# Altium project EvoHD_Pro.PrjPcb
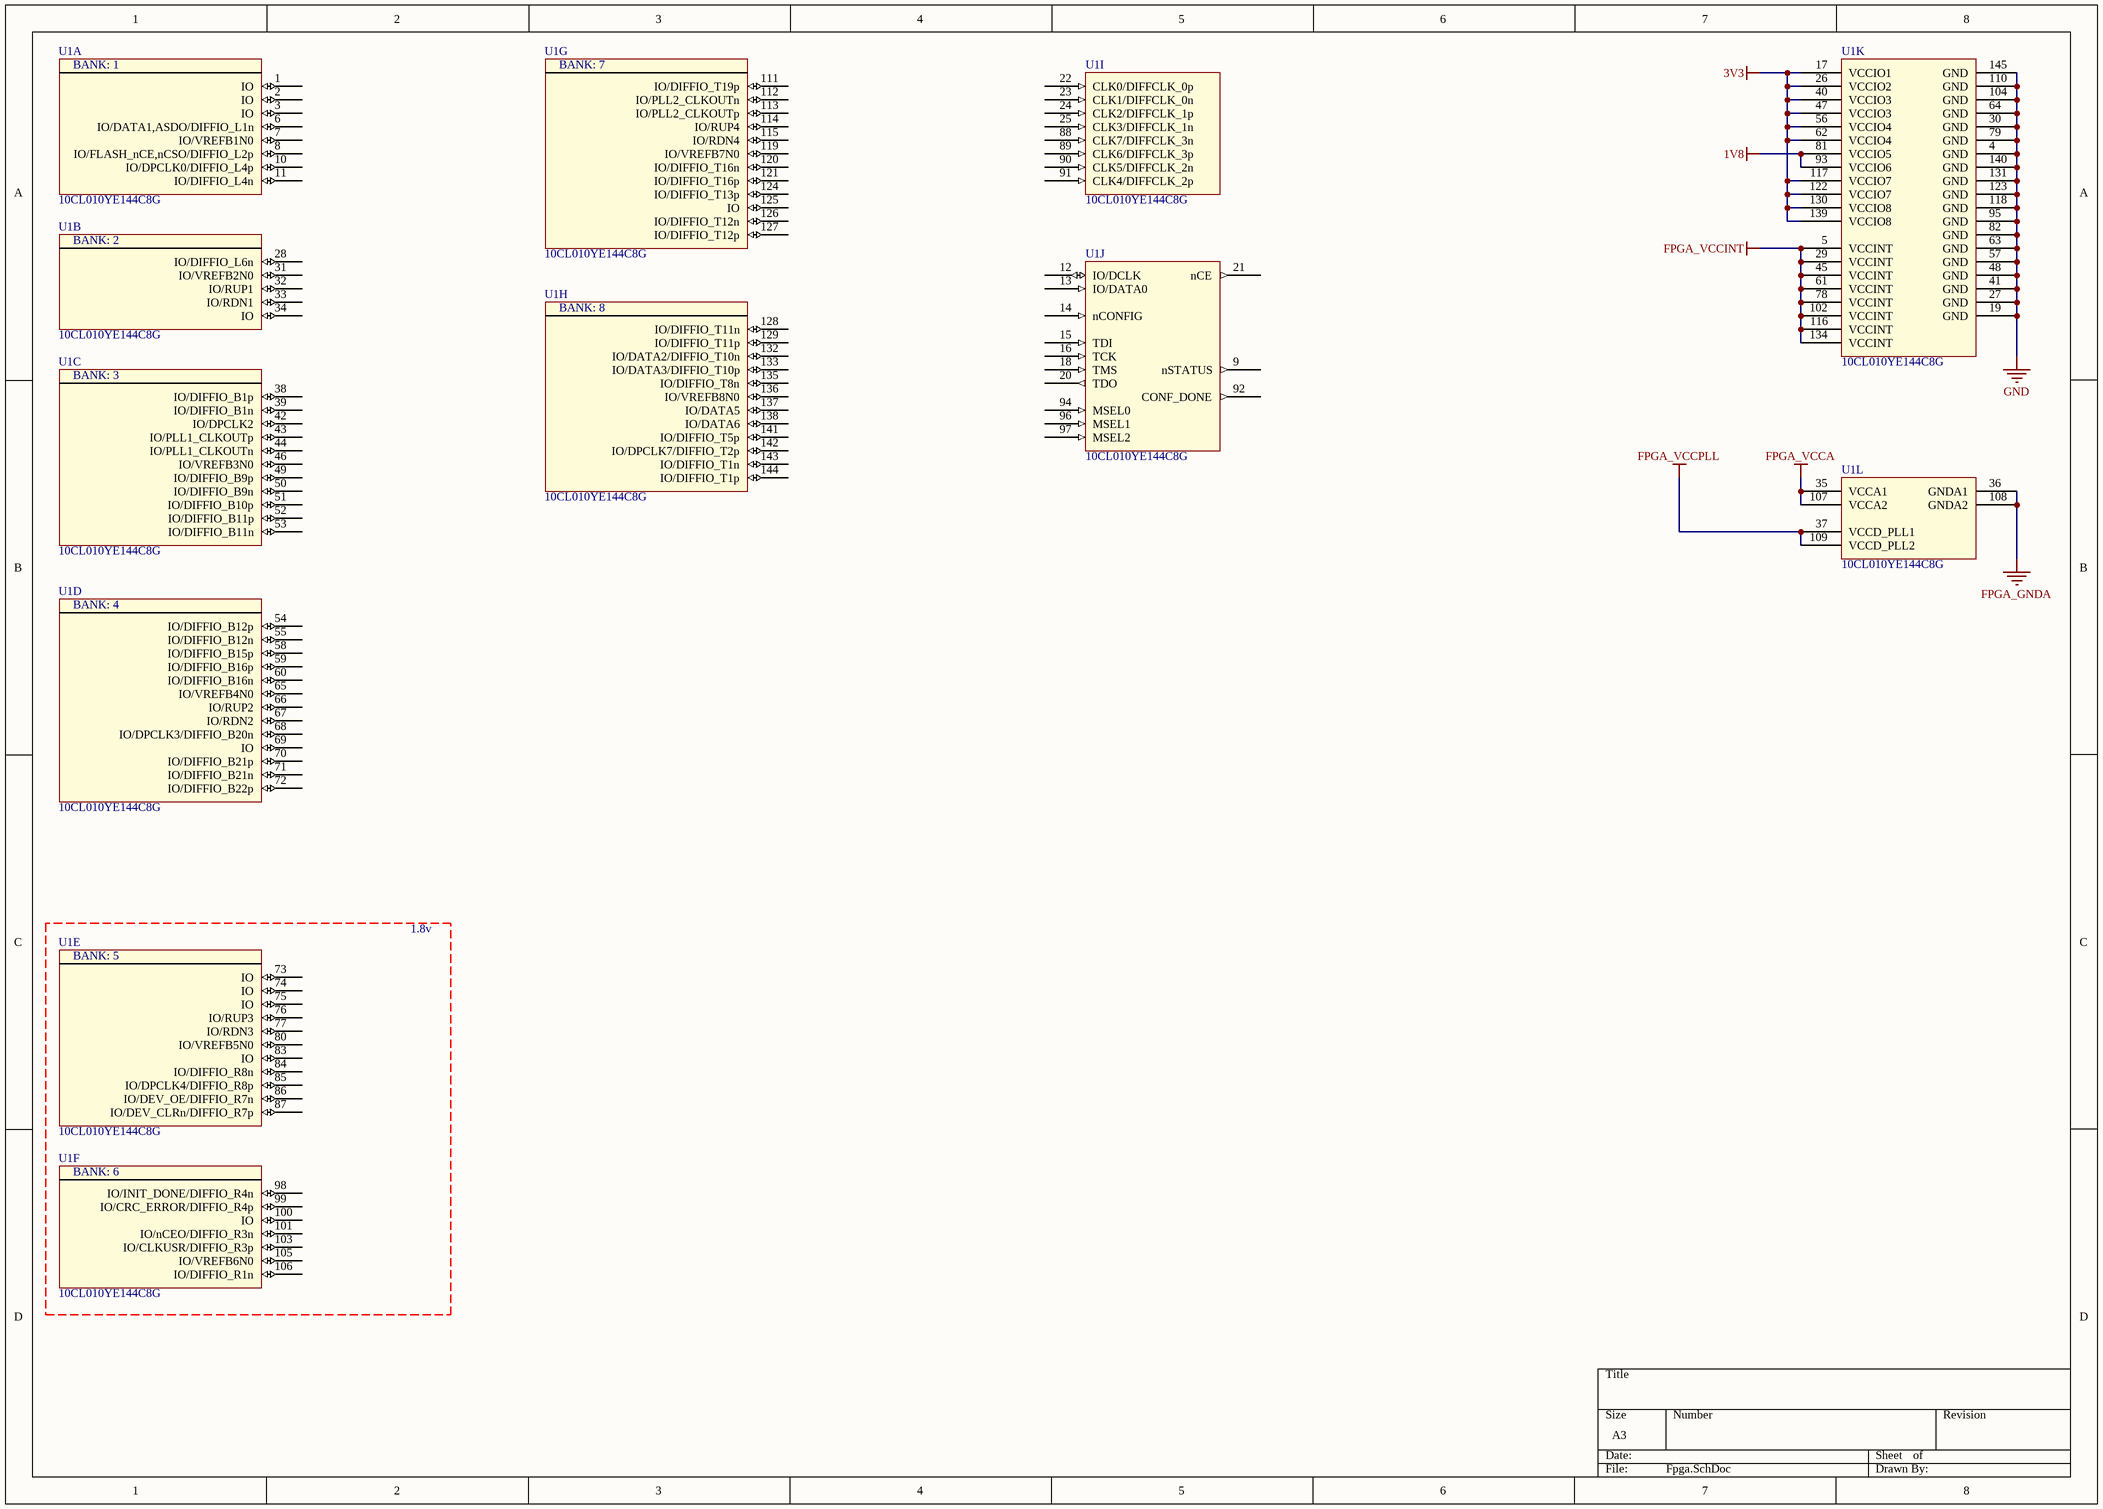
[diagram p0: Fpga.SchDoc]
7 sheets, 8 parts. Net scope: global (net labels, ports and power ports of the same name join across sheets).
Board file: EvoHD_Pro_RevA.PcbDoc
Sheets:
  Power.SchDoc
  Fpga.SchDoc
  Network.SchDoc
  Bus.SchDoc
  Hdmi.SchDoc
  Memory.SchDoc
  Connectors.SchDoc

## Sheet Power.SchDoc
size A4; SheetNumber: 1; SheetTotal: 1

## Sheet Fpga.SchDoc
size A3; SheetNumber: 2; SheetTotal: 7

### Parts
U1  10CL010YE144C8G  [Altera TQFP 50P 22X22 145N]  (parts A,B,C,D,E,F,G,H,I,J,K,L of 12)

### Blocks framed on the sheet
1.8v: U1

### Nets
1V8: U1.81(VCCIO5) U1.93(VCCIO6)
3V3: U1.17(VCCIO1) U1.26(VCCIO2) U1.40(VCCIO3) U1.47(VCCIO3) U1.56(VCCIO4) U1.62(VCCIO4) U1.117(VCCIO7) U1.122(VCCIO7) U1.130(VCCIO8) U1.139(VCCIO8)
FPGA_GNDA: U1.36(GNDA1) U1.108(GNDA2)
FPGA_VCCA: U1.35(VCCA1) U1.107(VCCA2)
FPGA_VCCINT: U1.5(VCCINT) U1.29(VCCINT) U1.45(VCCINT) U1.61(VCCINT) U1.78(VCCINT) U1.102(VCCINT) U1.116(VCCINT) U1.134(VCCINT)
FPGA_VCCPLL: U1.37(VCCD_PLL1) U1.109(VCCD_PLL2)
GND: U1.4(GND) U1.19(GND) U1.27(GND) U1.30(GND) U1.41(GND) U1.48(GND) U1.57(GND) U1.63(GND) U1.64(GND) U1.79(GND) U1.82(GND) U1.95(GND) U1.104(GND) U1.110(GND) U1.118(GND) U1.123(GND) U1.131(GND) U1.140(GND) U1.145(GND)

Not connected (* = marked no-connect by the designer): U1 1(IO) 2(IO) 3(IO) 6(IO/DATA1,ASDO/DIFFIO_L1n) 7(IO/VREFB1N0) 8(IO/FLASH_nCE,nCSO/DIFFIO_L2p) 9(nSTATUS) 10(IO/DPCLK0/DIFFIO_L4p) 11(IO/DIFFIO_L4n) 12(IO/DCLK) 13(IO/DATA0) 14(nCONFIG) 15(TDI) 16(TCK) 18(TMS) 20(TDO) 21(nCE) 22(CLK0/DIFFCLK_0p) 23(CLK1/DIFFCLK_0n) 24(CLK2/DIFFCLK_1p) 25(CLK3/DIFFCLK_1n) 28(IO/DIFFIO_L6n) 31(IO/VREFB2N0) 32(IO/RUP1) 33(IO/RDN1) 34(IO) 38(IO/DIFFIO_B1p) 39(IO/DIFFIO_B1n) 42(IO/DPCLK2) 43(IO/PLL1_CLKOUTp) 44(IO/PLL1_CLKOUTn) 46(IO/VREFB3N0) 49(IO/DIFFIO_B9p) 50(IO/DIFFIO_B9n) 51(IO/DIFFIO_B10p) 52(IO/DIFFIO_B11p) 53(IO/DIFFIO_B11n) 54(IO/DIFFIO_B12p) 55(IO/DIFFIO_B12n) 58(IO/DIFFIO_B15p) 59(IO/DIFFIO_B16p) 60(IO/DIFFIO_B16n) 65(IO/VREFB4N0) 66(IO/RUP2) 67(IO/RDN2) 68(IO/DPCLK3/DIFFIO_B20n) 69(IO) 70(IO/DIFFIO_B21p) 71(IO/DIFFIO_B21n) 72(IO/DIFFIO_B22p) 73(IO) 74(IO) 75(IO) 76(IO/RUP3) 77(IO/RDN3) 80(IO/VREFB5N0) 83(IO) 84(IO/DIFFIO_R8n) 85(IO/DPCLK4/DIFFIO_R8p) 86(IO/DEV_OE/DIFFIO_R7n) 87(IO/DEV_CLRn/DIFFIO_R7p) 88(CLK7/DIFFCLK_3n) 89(CLK6/DIFFCLK_3p) 90(CLK5/DIFFCLK_2n) 91(CLK4/DIFFCLK_2p) 92(CONF_DONE) 94(MSEL0) 96(MSEL1) 97(MSEL2) 98(IO/INIT_DONE/DIFFIO_R4n) 99(IO/CRC_ERROR/DIFFIO_R4p) 100(IO) 101(IO/nCEO/DIFFIO_R3n) 103(IO/CLKUSR/DIFFIO_R3p) 105(IO/VREFB6N0) 106(IO/DIFFIO_R1n) 111(IO/DIFFIO_T19p) 112(IO/PLL2_CLKOUTn) 113(IO/PLL2_CLKOUTp) 114(IO/RUP4) 115(IO/RDN4) 119(IO/VREFB7N0) 120(IO/DIFFIO_T16n) 121(IO/DIFFIO_T16p) 124(IO/DIFFIO_T13p) 125(IO) 126(IO/DIFFIO_T12n) 127(IO/DIFFIO_T12p) 128(IO/DIFFIO_T11n) 129(IO/DIFFIO_T11p) 132(IO/DATA2/DIFFIO_T10n) 133(IO/DATA3/DIFFIO_T10p) 135(IO/DIFFIO_T8n) 136(IO/VREFB8N0) 137(IO/DATA5) 138(IO/DATA6) 141(IO/DIFFIO_T5p) 142(IO/DPCLK7/DIFFIO_T2p) 143(IO/DIFFIO_T1n) 144(IO/DIFFIO_T1p)

### Notes on the sheet
- (in symbol 10CL010YE144C8G, part A) BANK: 1
- (in symbol 10CL010YE144C8G, part B) BANK: 2
- (in symbol 10CL010YE144C8G, part C) BANK: 3
- (in symbol 10CL010YE144C8G, part D) BANK: 4
- (in symbol 10CL010YE144C8G, part E) BANK: 5
- (in symbol 10CL010YE144C8G, part F) BANK: 6
- (in symbol 10CL010YE144C8G, part G) BANK: 7
- (in symbol 10CL010YE144C8G, part H) BANK: 8

### Library data of the parts
U1 = 10CL010YE144C8G: Intel® Cyclone®10 10CL010 Device

## Sheet Network.SchDoc
size A4; SheetNumber: 3; SheetTotal: 6
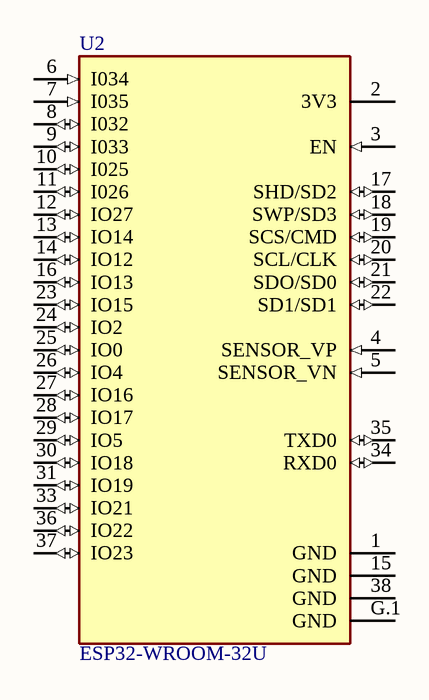
[diagram p1: Network.SchDoc]

### Parts
U2  ESP32-WROOM-32U  [XCVR_ESP32-WROOM-32U]

### Nets

Not connected (* = marked no-connect by the designer): U2 1(GND) 2(3V3) 3(EN) 4(SENSOR_VP) 5(SENSOR_VN) 6(I034) 7(I035) 8(I032) 9(I033) 10(I025) 11(I026) 12(IO27) 13(IO14) 14(IO12) 15(GND) 16(IO13) 17(SHD/SD2) 18(SWP/SD3) 19(SCS/CMD) 20(SCL/CLK) 21(SDO/SD0) 22(SD1/SD1) 23(IO15) 24(IO2) 25(IO0) 26(IO4) 27(IO16) 28(IO17) 29(IO5) 30(IO18) 31(IO19) 33(IO21) 34(RXD0) 35(TXD0) 36(IO22) 37(IO23) 38(GND) G.1(GND)

### Library data of the parts
U2 = ESP32-WROOM-32U: Bluetooth, WiFi 802.11b/g/n, Bluetooth v4.2 +EDR, Class 1, 2 and 3 Transceiver Module 2.4GHz ~ 2.5GHz Antenna Not Included, U.FL Surface Mount; MF: Espressif Systems; Value: *; SnapEDA_Link: https://www.snapeda.com/parts/ESP32-WROOM-32U/Espressif%20Systems/view-part/2472476/?ref=snap; Availability: Unavailable; Price: None; DigiKey-Purchase-URL: https://snapeda.com/shop?store=DigiKey&id=2472476; Package: Module Espressif Systems; MP: ESP32-WROOM-32U

## Sheet Bus.SchDoc
size A4; SheetNumber: 4; SheetTotal: 4

## Sheet Hdmi.SchDoc
size A4; SheetNumber: 5; SheetTotal: 6
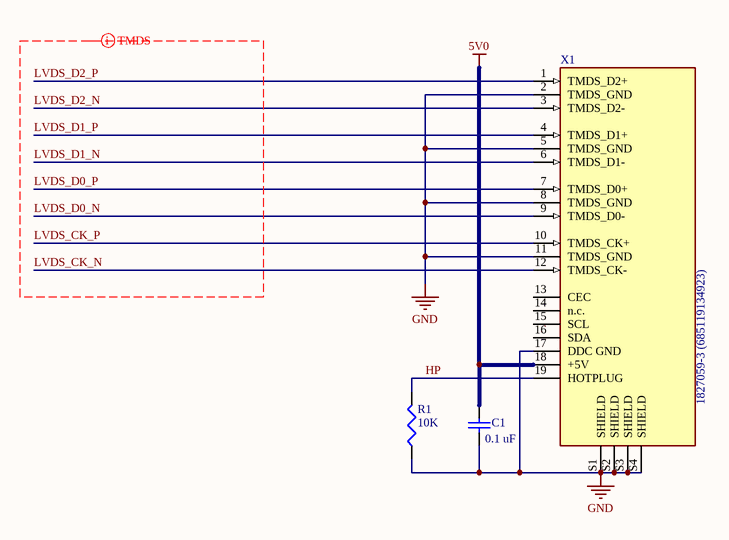
[diagram p2: Hdmi.SchDoc]

### Parts
C1  0.1 uF  [0805 chip cap]
R1  10K  [0805 CHIP RES]
X1  1827059-3 (685119134923)  [1827059-3 (685119134923)]

### Nets
5V0: C1.2 X1.18(+5V)
GND: C1.1 R1.1 X1.2(TMDS_GND) X1.5(TMDS_GND) X1.8(TMDS_GND) X1.11(TMDS_GND) X1.17(DDC_GND) X1.S1(SHIELD) X1.S2(SHIELD) X1.S3(SHIELD) X1.S4(SHIELD)
HP: R1.2 X1.19(HOTPLUG)
LVDS_CK_N: X1.12(TMDS_CK-)
LVDS_CK_P: X1.10(TMDS_CK+)
LVDS_D0_N: X1.9(TMDS_D0-)
LVDS_D0_P: X1.7(TMDS_D0+)
LVDS_D1_N: X1.6(TMDS_D1-)
LVDS_D1_P: X1.4(TMDS_D1+)
LVDS_D2_N: X1.3(TMDS_D2-)
LVDS_D2_P: X1.1(TMDS_D2+)

Not connected (* = marked no-connect by the designer): X1 13(CEC) 14(n.c.) 15(SCL) 16(SDA)

### Layout directives
differential pair; differential pair class TDMS_DIFF; net class TDMS: LVDS_CK_N, LVDS_CK_P, LVDS_D0_N, LVDS_D0_P, LVDS_D1_N, LVDS_D1_P, LVDS_D2_N, LVDS_D2_P

### Library data of the parts
C1 = Cap: Capacitor; Value: 0.1 uF
R1 = CHIP RES: Resistor; Value: 10K
X1 = 1827059-3 (685119134923): HDMI Connector | Right Angle | Without Flange | -20C to 85C / 1827059-3 / KLS1-285-1-N-1-R / 1747981-1 / 685119134923; MP: SS-53000-001; MF: Stewart Connector; Price: None; SnapEDA_Link: https://www.snapeda.com/parts/SS-53000-001/Stewart%20Connector/view-part/4628816/?ref=snap; Availability: Unavailable; Value: *; Package: None

## Sheet Memory.SchDoc
size A4; SheetNumber: 6; SheetTotal: 6

## Sheet Connectors.SchDoc
size A4; SheetNumber: 7; SheetTotal: 7
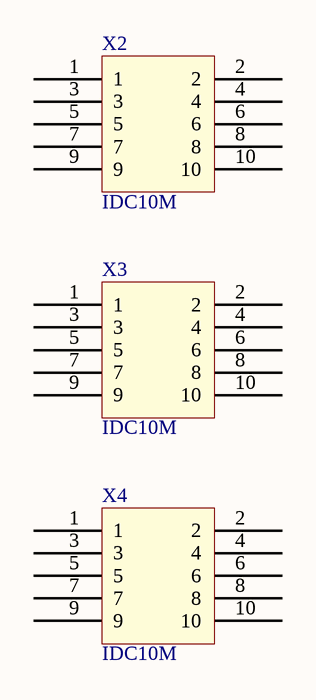
[diagram p3: Connectors.SchDoc]

### Parts
X2  IDC10M  [IDC10M]
X3  IDC10M  [IDC10M]
X4  IDC10M  [IDC10M]

### Nets

Not connected (* = marked no-connect by the designer): X2 1 2 3 4 5 6 7 8 9 10; X3 1 2 3 4 5 6 7 8 9 10; X4 1 2 3 4 5 6 7 8 9 10

## Nets that join several sheets
GND: Fpga (19 pins), Hdmi (11 pins)